# EAGLE schematic ghidorah9 (EAGLE 7.7.0)
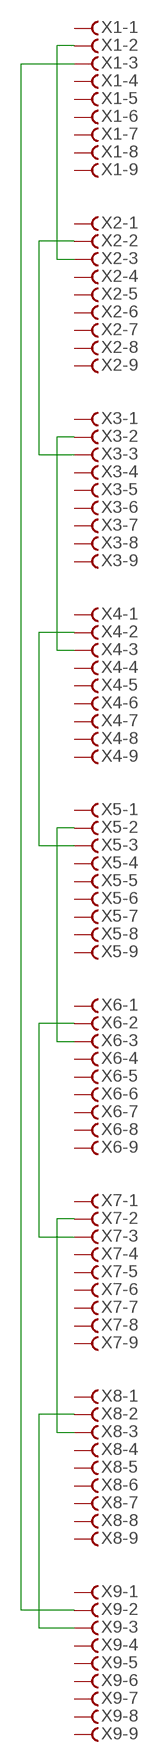
[diagram p0: schematic, sheet 1]

## Parts
X1  F09DS  [F09D]
X2  F09DS  [F09D]
X3  F09DS  [F09D]
X4  F09DS  [F09D]
X5  F09DS  [F09D]
X6  F09DS  [F09D]
X7  F09DS  [F09D]
X8  F09DS  [F09D]
X9  F09VS  [F09V]

## Nets
N$1: X1.2 X2.3
N$2: X2.2 X3.3
N$3: X3.2 X4.3
N$4: X4.2 X5.3
N$5: X5.2 X6.3
N$6: X6.2 X7.3
N$7: X7.2 X8.3
N$8: X8.2 X9.3
N$9: X1.3 X9.2
Unconnected: X1.1 X1.4 X1.5 X1.6 X1.7 X1.8 X1.9 X2.1 X2.4 X2.5 X2.6 X2.7 X2.8 X2.9 X3.1 X3.4 X3.5 X3.6 X3.7 X3.8 X3.9 X4.1 X4.4 X4.5 X4.6 X4.7 X4.8 X4.9 X5.1 X5.4 X5.5 X5.6 X5.7 X5.8 X5.9 X6.1 X6.4 X6.5 X6.6 X6.7 X6.8 X6.9 X7.1 X7.4 X7.5 X7.6 X7.7 X7.8 X7.9 X8.1 X8.4 X8.5 X8.6 X8.7 X8.8 X8.9 X9.1 X9.4 X9.5 X9.6 X9.7 X9.8 X9.9

## Library data of the parts
X1-X9 = con-subd:F09?S: SUB-D; OC_FARNELL: unknown; OC_NEWARK: unknown